# Altium schematic sheet Inverter and Drivers.SchDoc
size A3
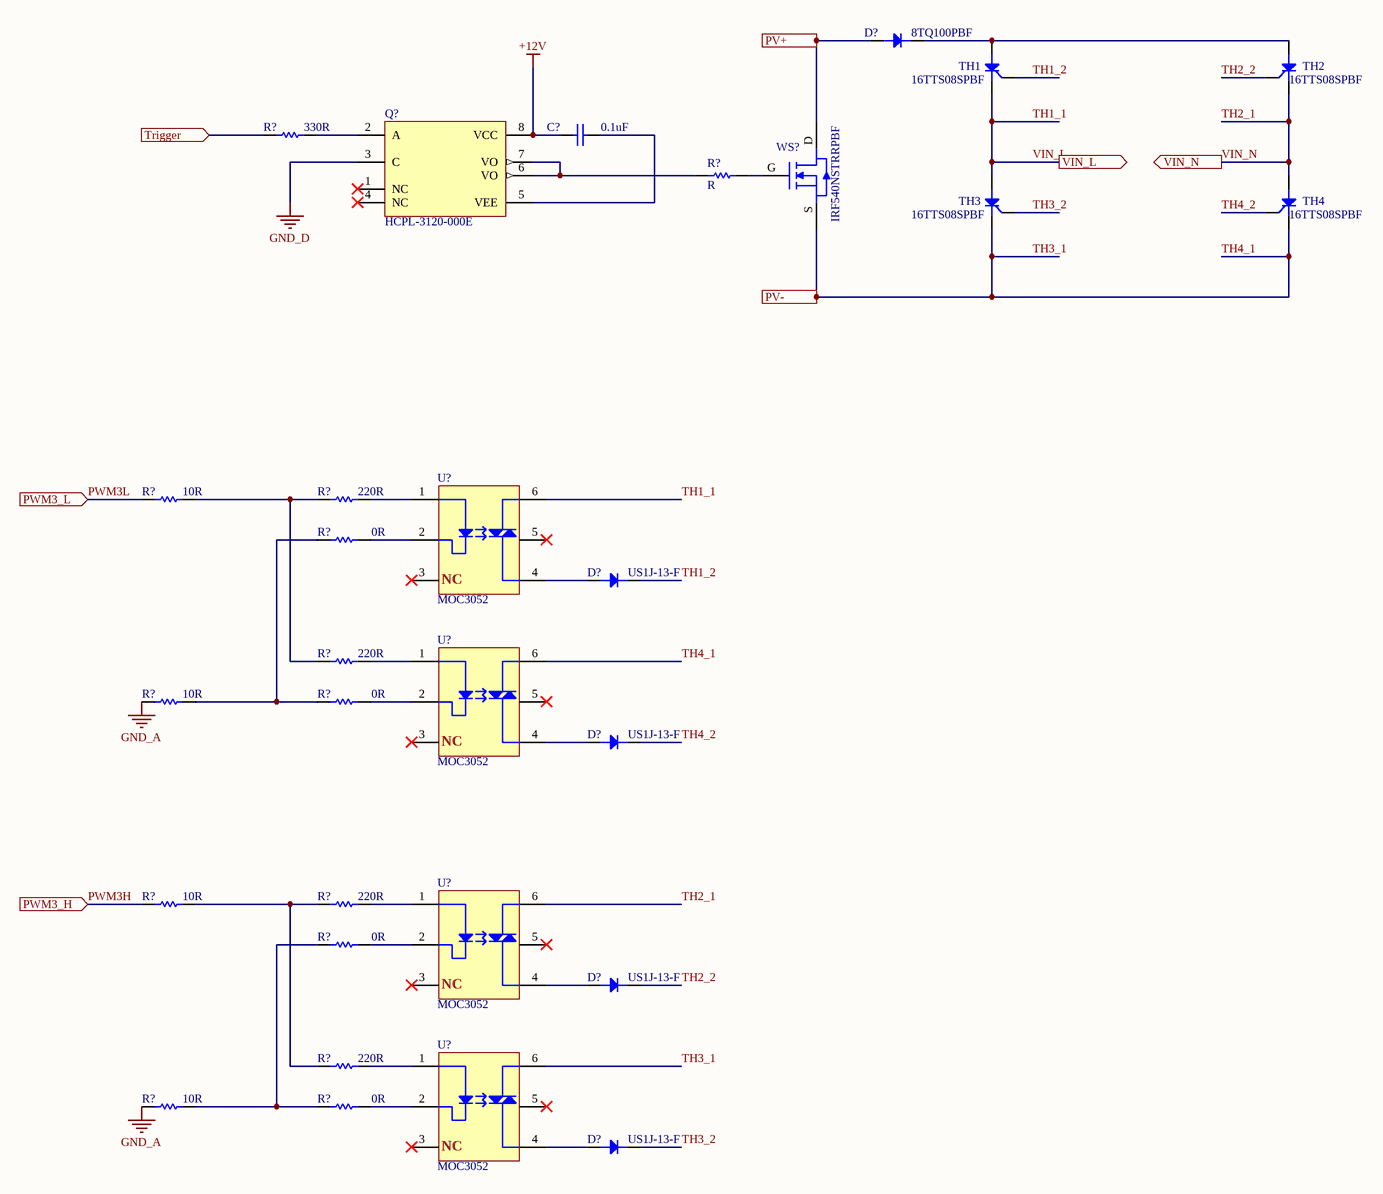
[diagram p0: Inverter and Drivers.SchDoc]

## Parts
(Parts that share a designator on the sheet are numbered #1, #2 ... from top to bottom, then left to right.)
C?  0.1uF  [1206 CAPACITOR]
D?#1  8TQ100PBF  [TO-220-2PIN]
D?#2  US1J-13-F  [SOT-523F]
D?#3  US1J-13-F  [SOT-523F]
D?#4  US1J-13-F  [SOT-523F]
D?#5  US1J-13-F  [SOT-523F]
Q?  HCPL-3120-000E  [FP-DIP-8-MFG]
R?#1  330R  [1206 Resistor Footprint]
R?#2  R  [1206 Resistor Footprint]
R?#3  10R  [1206 Resistor Footprint]
R?#4  220R  [1206 Resistor Footprint]
R?#5  0R  [1206 Resistor Footprint]
R?#6  220R  [1206 Resistor Footprint]
R?#7  10R  [1206 Resistor Footprint]
R?#8  0R  [1206 Resistor Footprint]
R?#9  10R  [1206 Resistor Footprint]
R?#10  220R  [1206 Resistor Footprint]
R?#11  0R  [1206 Resistor Footprint]
R?#12  220R  [1206 Resistor Footprint]
R?#13  10R  [1206 Resistor Footprint]
R?#14  0R  [1206 Resistor Footprint]
TH1  16TTS08SPBF
TH2  16TTS08SPBF
TH3  16TTS08SPBF
TH4  16TTS08SPBF
U?#1  MOC3052  [SDIP6]
U?#2  MOC3052  [SDIP6]
U?#3  MOC3052  [SDIP6]
U?#4  MOC3052  [SDIP6]
WS?  IRF540NSTRRPBF

## Ports
PV+, PV-, PWM3_H (in), PWM3_L (in), Trigger (in), VIN_L (out), VIN_N (out)

## Nets
+12V: C?.1 Q?.8(VCC)
GND_A: R?#7.1 R?#13.1
GND_D: Q?.3(C)
PV+: D?#1.A WS?.D ; port PV+
PWM3H: R?#9.1 ; port PWM3_H
PWM3L: R?#3.1 ; port PWM3_L
TH1_1: TH1.K TH3.A U?#1.6 ; port VIN_L  [also labelled VIN_L]
TH1_2: D?#2.K TH1.1
TH2_1: TH2.K TH4.A U?#3.6 ; port VIN_N  [also labelled VIN_N]
TH2_2: D?#4.K TH2.1
TH3_1: TH3.K TH4.K U?#2.6 U?#4.6 WS?.S ; port PV-  [also labelled TH4_1]
TH3_2: D?#5.K TH3.1
TH4_2: D?#3.K TH4.1
Trigger: R?#1.1 ; port Trigger
NetC?_2: C?.2 Q?.5(VEE)
NetD?#1_K: D?#1.K TH1.A TH2.A
NetD?#2_A: D?#2.A U?#1.4
NetD?#3_A: D?#3.A U?#2.4
NetD?#4_A: D?#4.A U?#3.4
NetD?#5_A: D?#5.A U?#4.4
NetQ?_2: Q?.2(A) R?#1.2
NetQ?_6: Q?.6(VO) Q?.7(VO) R?#2.1
NetR?#2_2: R?#2.2 WS?.G
NetR?#3_2: R?#3.2 R?#4.1 R?#6.1
NetR?#4_2: R?#4.2 U?#1.1
NetR?#5_1: R?#5.1 R?#7.2 R?#8.1
NetR?#5_2: R?#5.2 U?#1.2
NetR?#6_2: R?#6.2 U?#2.1
NetR?#8_2: R?#8.2 U?#2.2
NetR?#9_2: R?#9.2 R?#10.1 R?#12.1
NetR?#10_2: R?#10.2 U?#3.1
NetR?#11_1: R?#11.1 R?#13.2 R?#14.1
NetR?#11_2: R?#11.2 U?#3.2
NetR?#12_2: R?#12.2 U?#4.1
NetR?#14_2: R?#14.2 U?#4.2

Not connected (* = marked no-connect by the designer): Q? 1(NC)* 4(NC)*; U?#1 3* 5*; U?#2 3* 5*; U?#3 3* 5*; U?#4 3* 5*

## Notes on the sheet
- (in symbol MOC3052) NC

## Library data of the parts
C? = Capacitor Non-Polorized: Value: 10uF; Case-EIA: 1206; Tolerance: -20% to +80%; Rated Voltage: 25 V; Case-Metric: 3216; Max Thickness: 1.9 mm; Technology: SMT
D?#1 = 8TQ100PBF: Diode Schottky 100V 8A Through Hole TO-220AC; MF: Vishay Semiconductor; SnapEDA_Link: https://www.snapeda.com/parts/8TQ100PBF/Vishay%20Semiconductor%20Diodes%20Division/view-part/454671/?ref=snap; Price: None; MP: 8TQ100PBF; Value: *; Availability: Unavailable; Package: TO-220 Vishay
D?#2-D?#5 = Diode
Q? = HCPL-3120-000E: OPTOISO 3.75KV 1CH GATE DVR 8DIP; Manufacturer: Broadcom; Power Dissipation: 295mW; Turn On Delay Time: 0.3us; Min Supply Voltage: 15V; Isolation Voltage: 3750Vrms; Reverse Voltage: 5V; Forward Voltage: 1.5V; Max Supply Voltage: 30V; Forward Current: 10mA; Standoff Height: 0.51mm; Temperature Range Low: -40°C; Device Class L2: Optocouplers; Automotive: No; Mouser Description: Optocoupler; THT; Channels: 1; Out: IGBT driver; 35kV/µs; 3.75kV; Height: 4.7mm; Digikey Description: OPTOISO 3.75KV 1CH GATE DVR 8DIP; Turn Off Delay Time: 0.3us; Device Class L3: unset; Package: DIP-8; RoHS: TRUE; ComponentLink2URL: https://docs.broadcom.com/docs/AV02-0161EN; Temperature: -40°C to +100°C; Temperature Range High: +100°C; Octopart: https://octopart.com/hcpl-3120-000e-broadcom-71128428; Manufacturer Part Number: HCPL-3120-000E; Category: Trans; Device Class L1: Optoelectronics; ComponentLink2Description: Datasheet; Lead Free: Yes; Ambient Temperature Range Low: -40°C; Ambient Temperature Range High: +100°C
R?#1-R?#14 = Resistor
TH1-TH4 = 16TTS08SPBF: Vishay, 16TTS08SPBF, Thyristor, 800V 10A, 60mA 3-pin, D2PAK; Hold Current: 100mA; RMS Current (Irms): 16A; Supplier 1: RSComponents; Manufacturer: Vishay; Manufacturer Part Number: 16TTS08SPBF; RoHS: Yes; Category: Thyristors; Mount: Surface Mount; Case/Package: D2PAK; Number of Pins: 3; Min Operating Temperature: -40°C; Max Operating Temperature: 125°C; Packaging: Rail/Tube; Max Repetitive Reverse Voltage (Vrrm): 800V; Current: 16A; Voltage: 800V; Length: 10.67mm; Height: 4.83mm; Width: 9.65mm; Lead Free: Lead Free; ComponentLink1URL: https://datasheet.ciiva.com/14801/vs-16tts08s-14801778.pdf?src-supplier=Arrow; ComponentLink1Description: https://datasheet.ciiva.com/14801/vs-16tts08s-14801778.pdf?src-supplier=Arrow; ComponentLink2URL: https://datasheet.ciiva.com/25624/0900766b800a9d57-25624882.pdf?src-supplier=RSComponents; ComponentLink2Description: https://datasheet.ciiva.com/25624/0900766b800a9d57-25624882.pdf?src-supplier=RSComponents; ComponentLink3URL: https://datasheet.ciiva.com/15247/vs-16tts08s-15247366.pdf?src-supplier=Arrow+Europe; ComponentLink3Description: https://datasheet.ciiva.com/15247/vs-16tts08s-15247366.pdf?src-supplier=Arrow+Europe; ComponentLink4URL: https://datasheet.ciiva.com/14166/07209018-14166634.pdf?src-supplier=Distrelec; ComponentLink4Description: https://datasheet.ciiva.com/14166/07209018-14166634.pdf?src-supplier=Distrelec; Supplier Part Number 1: 2640717P
U?#1-U?#4 = MOC3052: SCR Optoizolator
WS? = IRF540NSTRRPBF: Transistor MOSFET N Channel 100 Volt 33 Amp 3-Pin 2+ Tab D2pak Tape And Reel; Manufacturer: International Rectifier; Continuous Drain Current (ID): 33A; Gate to Source Voltage (Vgs): 20V; Rise Time: 35ns; Turn-Off Delay Time: 39ns; Turn-On Delay Time: 11ns; Power Dissipation: 130W; Number of Elements: 1; Drain to Source Voltage (Vdss): 100V; Max Power Dissipation: 3.8W; Rds On Max: 8.4mR; Input Capacitance: 2.29nF; Drain to Source Resistance: 44mR; Element Configuration: Single; Nominal Vgs: 4V; Supplier 1: Future Electronics; Manufacturer Part Number: IRF540NSTRRPBF; RoHS: Yes; Category: MOSFETs; Stock 1: 12403; Pricing 1: 1=1.14000, 50=1.00000, 100=0.98500, 250=0.95500, 500=0.93500 (USD); Mount: Surface Mount; Case/Package: D2PAK; Number of Pins: 3; Min Operating Temperature: -55°C; Max Operating Temperature: 175°C; Packaging: Tape and Reel; Fall Time: 35ns; Package Quantity: 800; Drain to Source Breakdown Voltage: 100V; Voltage Rating (DC): 100V; Current Rating: 33A; Length: 10.67mm; Height: 4.83mm; Width: 9.65mm; Radiation Hardening: No; Lead Free: Lead Free; REACH SVHC: No SVHC; ComponentLink1URL: https://datasheet.ciiva.com/6370/irf540nspbf-6370457.pdf?src-supplier=Digi-Key; ComponentLink1Description: https://datasheet.ciiva.com/6370/irf540nspbf-6370457.pdf?src-supplier=Digi-Key; ComponentLink2URL: https://datasheet.ciiva.com/6370/irf540nspbf-6370459.pdf?src-supplier=Digi-Key; ComponentLink2Description: https://datasheet.ciiva.com/6370/irf540nspbf-6370459.pdf?src-supplier=Digi-Key; ComponentLink3URL: https://datasheet.ciiva.com/6370/irf540nspbf-6370462.pdf?src-supplier=Digi-Key; ComponentLink3Description: https://datasheet.ciiva.com/6370/irf540nspbf-6370462.pdf?src-supplier=Digi-Key; Supplier Part Number 1: IRF540NSTRLPBF-CUTT